# Altium schematic sheet LPCB220 - OVERVIEW.SchDoc
size A3; Address1: Factory 10; Address2: 9-13 Dingley Avenue, Dandeong, VICTORIA 3175, AUSTRALIA; DocumentNumber: 1; Revision: 1; SheetNumber: 1; SheetTotal: 18; Lockie__PCB_SUB_ASSEMBLY: Top Overview; Lockie__PCB_ASSEMBLY: Brake Control; Lockie__LDL: LPCB220; Lockie__PCB_DESCRIPTION: Redundant Stepper Node
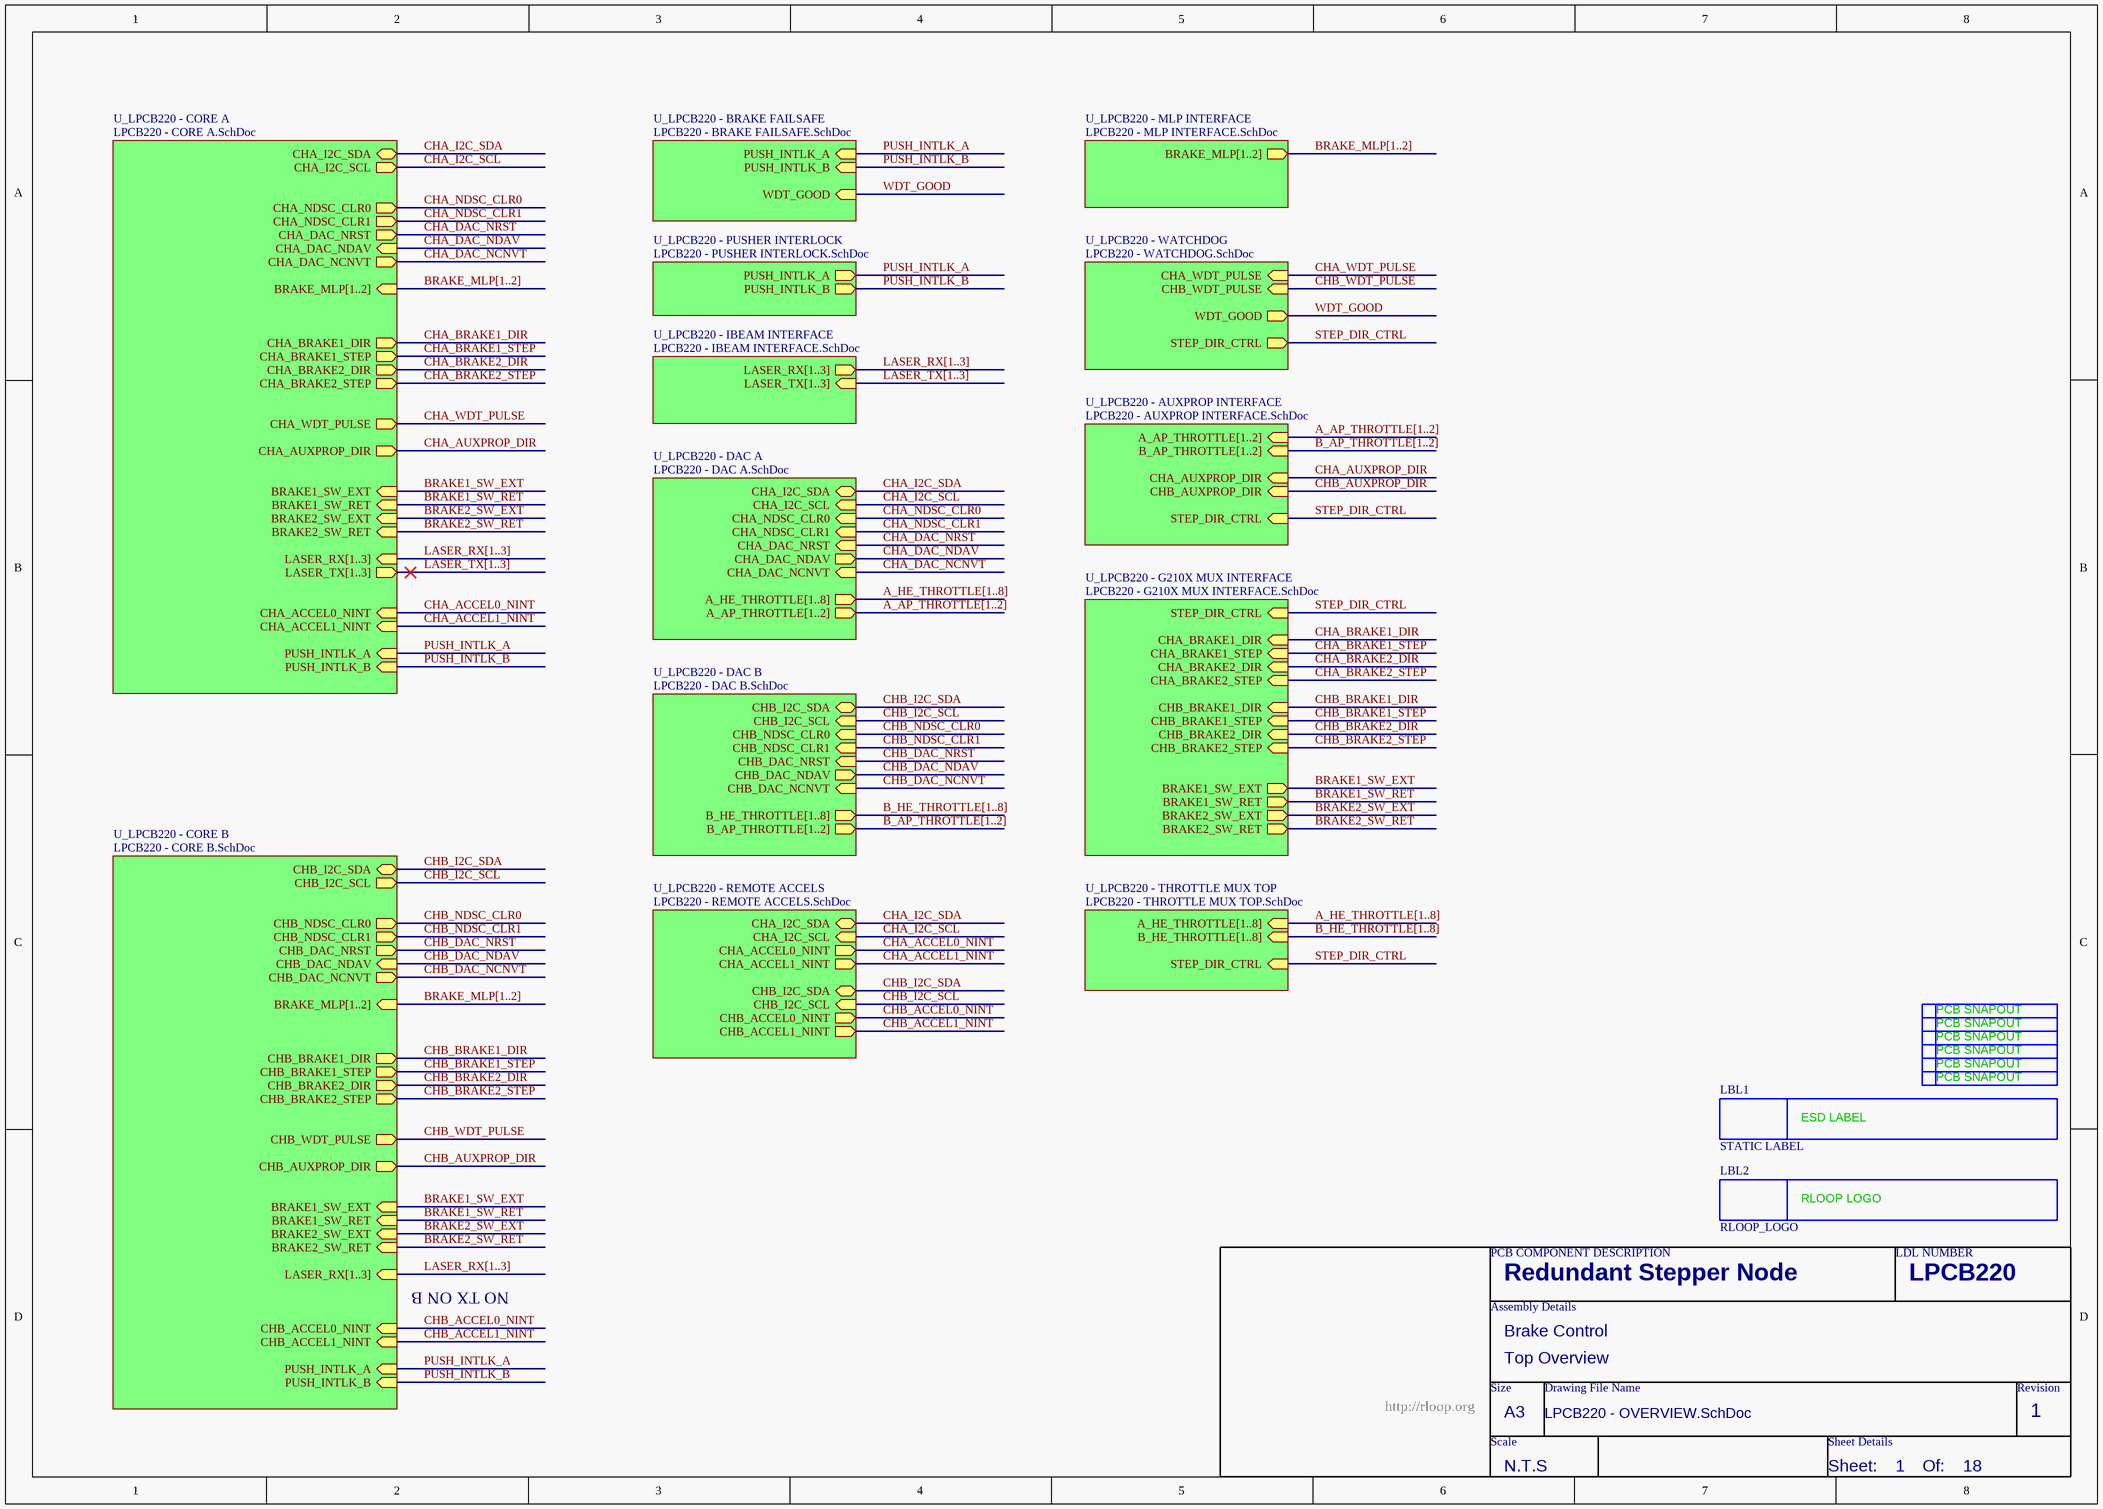
[diagram p0: LPCB220 - OVERVIEW.SchDoc]

## Parts
LBL1  STATIC LABEL  [STATIC_LABEL]  (no BOM)
LBL2  RLOOP_LOGO  [RLOOP_LOGO]  (no BOM)
SN1  PCB_SNAPOUT  [SNAPOUT_NEW]  (value not drawn)  (no BOM)
SN2  PCB_SNAPOUT  [SNAPOUT_NEW]  (value not drawn)  (no BOM)
SN3  PCB_SNAPOUT  [SNAPOUT_NEW]  (value not drawn)  (no BOM)
SN4  PCB_SNAPOUT  [SNAPOUT_NEW]  (value not drawn)  (no BOM)
SN5  PCB_SNAPOUT  [SNAPOUT_NEW]  (value not drawn)  (no BOM)
SN6  PCB_SNAPOUT  [SNAPOUT_NEW]  (value not drawn)  (no BOM)

## Sub-sheets
U_LPCB220 - AUXPROP INTERFACE = LPCB220 - AUXPROP INTERFACE.SchDoc: B_AP_THROTTLE[1..2] (in), A_AP_THROTTLE[1..2] (in), CHB_AUXPROP_DIR (in), CHA_AUXPROP_DIR (in), STEP_DIR_CTRL (in)
U_LPCB220 - BRAKE FAILSAFE = LPCB220 - BRAKE FAILSAFE.SchDoc: PUSH_INTLK_A (in), PUSH_INTLK_B (in), WDT_GOOD (in)
U_LPCB220 - CORE A = LPCB220 - CORE A.SchDoc: CHA_I2C_SDA (bidir), CHA_I2C_SCL (out), LASER_TX[1..3] (out), LASER_RX[1..3] (in), CHA_ACCEL0_NINT (in), CHA_ACCEL1_NINT (in), CHA_AUXPROP_DIR (out), CHA_DAC_NDAV (in), BRAKE1_SW_EXT (in), BRAKE1_SW_RET (in), BRAKE_MLP[1..2] (in), CHA_NDSC_CLR0 (out), CHA_NDSC_CLR1 (out), BRAKE2_SW_EXT (in), BRAKE2_SW_RET (in), PUSH_INTLK_A (in), PUSH_INTLK_B (in), CHA_WDT_PULSE (out), CHA_BRAKE1_DIR (out), CHA_BRAKE1_STEP (out), CHA_BRAKE2_DIR (out), CHA_BRAKE2_STEP (out), CHA_DAC_NRST (out), CHA_DAC_NCNVT (out)
U_LPCB220 - CORE B = LPCB220 - CORE B.SchDoc: CHB_I2C_SDA (bidir), CHB_I2C_SCL (out), LASER_RX[1..3] (in), CHB_ACCEL0_NINT (in), CHB_ACCEL1_NINT (in), CHB_AUXPROP_DIR (out), CHB_DAC_NDAV (in), BRAKE1_SW_EXT (in), BRAKE1_SW_RET (in), BRAKE_MLP[1..2] (in), CHB_NDSC_CLR0 (out), CHB_NDSC_CLR1 (out), BRAKE2_SW_EXT (in), BRAKE2_SW_RET (in), PUSH_INTLK_A (in), PUSH_INTLK_B (in), CHB_WDT_PULSE (out), CHB_BRAKE1_DIR (out), CHB_BRAKE1_STEP (out), CHB_BRAKE2_DIR (out), CHB_BRAKE2_STEP (out), CHB_DAC_NRST (out), CHB_DAC_NCNVT (out)
U_LPCB220 - DAC A = LPCB220 - DAC A.SchDoc: A_HE_THROTTLE[1..8] (out), A_AP_THROTTLE[1..2] (out), CHA_I2C_SDA (bidir), CHA_I2C_SCL (in), CHA_NDSC_CLR0 (in), CHA_NDSC_CLR1 (in), CHA_DAC_NRST (in), CHA_DAC_NDAV (out), CHA_DAC_NCNVT (in)
U_LPCB220 - DAC B = LPCB220 - DAC B.SchDoc: B_HE_THROTTLE[1..8] (out), B_AP_THROTTLE[1..2] (out), CHB_I2C_SDA (bidir), CHB_I2C_SCL (in), CHB_NDSC_CLR0 (in), CHB_NDSC_CLR1 (in), CHB_DAC_NRST (in), CHB_DAC_NDAV (out), CHB_DAC_NCNVT (in)
U_LPCB220 - G210X MUX INTERFACE = LPCB220 - G210X MUX INTERFACE.SchDoc: CHB_BRAKE1_DIR (in), CHA_BRAKE1_DIR (in), CHB_BRAKE2_DIR (in), CHA_BRAKE2_DIR (in), CHB_BRAKE1_STEP (in), CHA_BRAKE1_STEP (in), CHB_BRAKE2_STEP (in), CHA_BRAKE2_STEP (in), STEP_DIR_CTRL (in), BRAKE1_SW_EXT (out), BRAKE1_SW_RET (out), BRAKE2_SW_EXT (out), BRAKE2_SW_RET (out)
U_LPCB220 - IBEAM INTERFACE = LPCB220 - IBEAM INTERFACE.SchDoc: LASER_TX[1..3] (in), LASER_RX[1..3] (out)
U_LPCB220 - MLP INTERFACE = LPCB220 - MLP INTERFACE.SchDoc: BRAKE_MLP[1..2] (out)
U_LPCB220 - PUSHER INTERLOCK = LPCB220 - PUSHER INTERLOCK.SchDoc: PUSH_INTLK_A (out), PUSH_INTLK_B (out)
U_LPCB220 - REMOTE ACCELS = LPCB220 - REMOTE ACCELS.SchDoc: CHA_I2C_SCL (in), CHA_I2C_SDA (bidir), CHB_ACCEL0_NINT (out), CHA_ACCEL1_NINT (out), CHA_ACCEL0_NINT (out), CHB_ACCEL1_NINT (out), CHB_I2C_SCL (in), CHB_I2C_SDA (bidir)
U_LPCB220 - THROTTLE MUX TOP = LPCB220 - THROTTLE MUX TOP.SchDoc: B_HE_THROTTLE[1..8] (in), A_HE_THROTTLE[1..8] (in), STEP_DIR_CTRL (in)
U_LPCB220 - WATCHDOG = LPCB220 - WATCHDOG.SchDoc: CHA_WDT_PULSE (in), CHB_WDT_PULSE (in), STEP_DIR_CTRL (out), WDT_GOOD (out)

## Nets
BRAKE1_SW_EXT: sheet U_LPCB220 - CORE A/BRAKE1_SW_EXT, sheet U_LPCB220 - CORE B/BRAKE1_SW_EXT, sheet U_LPCB220 - G210X MUX INTERFACE/BRAKE1_SW_EXT
BRAKE1_SW_RET: sheet U_LPCB220 - CORE A/BRAKE1_SW_RET, sheet U_LPCB220 - CORE B/BRAKE1_SW_RET, sheet U_LPCB220 - G210X MUX INTERFACE/BRAKE1_SW_RET
BRAKE2_SW_EXT: sheet U_LPCB220 - CORE A/BRAKE2_SW_EXT, sheet U_LPCB220 - CORE B/BRAKE2_SW_EXT, sheet U_LPCB220 - G210X MUX INTERFACE/BRAKE2_SW_EXT
BRAKE2_SW_RET: sheet U_LPCB220 - CORE A/BRAKE2_SW_RET, sheet U_LPCB220 - CORE B/BRAKE2_SW_RET, sheet U_LPCB220 - G210X MUX INTERFACE/BRAKE2_SW_RET
CHA_ACCEL0_NINT: sheet U_LPCB220 - CORE A/CHA_ACCEL0_NINT, sheet U_LPCB220 - REMOTE ACCELS/CHA_ACCEL0_NINT
CHA_ACCEL1_NINT: sheet U_LPCB220 - CORE A/CHA_ACCEL1_NINT, sheet U_LPCB220 - REMOTE ACCELS/CHA_ACCEL1_NINT
CHA_AUXPROP_DIR: sheet U_LPCB220 - AUXPROP INTERFACE/CHA_AUXPROP_DIR, sheet U_LPCB220 - CORE A/CHA_AUXPROP_DIR
CHA_BRAKE1_DIR: sheet U_LPCB220 - CORE A/CHA_BRAKE1_DIR, sheet U_LPCB220 - G210X MUX INTERFACE/CHA_BRAKE1_DIR
CHA_BRAKE1_STEP: sheet U_LPCB220 - CORE A/CHA_BRAKE1_STEP, sheet U_LPCB220 - G210X MUX INTERFACE/CHA_BRAKE1_STEP
CHA_BRAKE2_DIR: sheet U_LPCB220 - CORE A/CHA_BRAKE2_DIR, sheet U_LPCB220 - G210X MUX INTERFACE/CHA_BRAKE2_DIR
CHA_BRAKE2_STEP: sheet U_LPCB220 - CORE A/CHA_BRAKE2_STEP, sheet U_LPCB220 - G210X MUX INTERFACE/CHA_BRAKE2_STEP
CHA_DAC_NCNVT: sheet U_LPCB220 - DAC A/CHA_DAC_NCNVT, sheet U_LPCB220 - CORE A/CHA_DAC_NCNVT
CHA_DAC_NDAV: sheet U_LPCB220 - DAC A/CHA_DAC_NDAV, sheet U_LPCB220 - CORE A/CHA_DAC_NDAV
CHA_DAC_NRST: sheet U_LPCB220 - DAC A/CHA_DAC_NRST, sheet U_LPCB220 - CORE A/CHA_DAC_NRST
CHA_I2C_SCL: sheet U_LPCB220 - DAC A/CHA_I2C_SCL, sheet U_LPCB220 - CORE A/CHA_I2C_SCL, sheet U_LPCB220 - REMOTE ACCELS/CHA_I2C_SCL
CHA_I2C_SDA: sheet U_LPCB220 - DAC A/CHA_I2C_SDA, sheet U_LPCB220 - CORE A/CHA_I2C_SDA, sheet U_LPCB220 - REMOTE ACCELS/CHA_I2C_SDA
CHA_NDSC_CLR0: sheet U_LPCB220 - DAC A/CHA_NDSC_CLR0, sheet U_LPCB220 - CORE A/CHA_NDSC_CLR0
CHA_NDSC_CLR1: sheet U_LPCB220 - DAC A/CHA_NDSC_CLR1, sheet U_LPCB220 - CORE A/CHA_NDSC_CLR1
CHA_WDT_PULSE: sheet U_LPCB220 - WATCHDOG/CHA_WDT_PULSE, sheet U_LPCB220 - CORE A/CHA_WDT_PULSE
CHB_ACCEL0_NINT: sheet U_LPCB220 - REMOTE ACCELS/CHB_ACCEL0_NINT, sheet U_LPCB220 - CORE B/CHB_ACCEL0_NINT
CHB_ACCEL1_NINT: sheet U_LPCB220 - REMOTE ACCELS/CHB_ACCEL1_NINT, sheet U_LPCB220 - CORE B/CHB_ACCEL1_NINT
CHB_AUXPROP_DIR: sheet U_LPCB220 - AUXPROP INTERFACE/CHB_AUXPROP_DIR, sheet U_LPCB220 - CORE B/CHB_AUXPROP_DIR
CHB_BRAKE1_DIR: sheet U_LPCB220 - CORE B/CHB_BRAKE1_DIR, sheet U_LPCB220 - G210X MUX INTERFACE/CHB_BRAKE1_DIR
CHB_BRAKE1_STEP: sheet U_LPCB220 - CORE B/CHB_BRAKE1_STEP, sheet U_LPCB220 - G210X MUX INTERFACE/CHB_BRAKE1_STEP
CHB_BRAKE2_DIR: sheet U_LPCB220 - CORE B/CHB_BRAKE2_DIR, sheet U_LPCB220 - G210X MUX INTERFACE/CHB_BRAKE2_DIR
CHB_BRAKE2_STEP: sheet U_LPCB220 - CORE B/CHB_BRAKE2_STEP, sheet U_LPCB220 - G210X MUX INTERFACE/CHB_BRAKE2_STEP
CHB_DAC_NCNVT: sheet U_LPCB220 - DAC B/CHB_DAC_NCNVT, sheet U_LPCB220 - CORE B/CHB_DAC_NCNVT
CHB_DAC_NDAV: sheet U_LPCB220 - DAC B/CHB_DAC_NDAV, sheet U_LPCB220 - CORE B/CHB_DAC_NDAV
CHB_DAC_NRST: sheet U_LPCB220 - DAC B/CHB_DAC_NRST, sheet U_LPCB220 - CORE B/CHB_DAC_NRST
CHB_I2C_SCL: sheet U_LPCB220 - DAC B/CHB_I2C_SCL, sheet U_LPCB220 - REMOTE ACCELS/CHB_I2C_SCL, sheet U_LPCB220 - CORE B/CHB_I2C_SCL
CHB_I2C_SDA: sheet U_LPCB220 - DAC B/CHB_I2C_SDA, sheet U_LPCB220 - REMOTE ACCELS/CHB_I2C_SDA, sheet U_LPCB220 - CORE B/CHB_I2C_SDA
CHB_NDSC_CLR0: sheet U_LPCB220 - DAC B/CHB_NDSC_CLR0, sheet U_LPCB220 - CORE B/CHB_NDSC_CLR0
CHB_NDSC_CLR1: sheet U_LPCB220 - DAC B/CHB_NDSC_CLR1, sheet U_LPCB220 - CORE B/CHB_NDSC_CLR1
CHB_WDT_PULSE: sheet U_LPCB220 - WATCHDOG/CHB_WDT_PULSE, sheet U_LPCB220 - CORE B/CHB_WDT_PULSE
PUSH_INTLK_A: sheet U_LPCB220 - BRAKE FAILSAFE/PUSH_INTLK_A, sheet U_LPCB220 - PUSHER INTERLOCK/PUSH_INTLK_A, sheet U_LPCB220 - CORE A/PUSH_INTLK_A, sheet U_LPCB220 - CORE B/PUSH_INTLK_A
PUSH_INTLK_B: sheet U_LPCB220 - BRAKE FAILSAFE/PUSH_INTLK_B, sheet U_LPCB220 - PUSHER INTERLOCK/PUSH_INTLK_B, sheet U_LPCB220 - CORE A/PUSH_INTLK_B, sheet U_LPCB220 - CORE B/PUSH_INTLK_B
STEP_DIR_CTRL: sheet U_LPCB220 - WATCHDOG/STEP_DIR_CTRL, sheet U_LPCB220 - AUXPROP INTERFACE/STEP_DIR_CTRL, sheet U_LPCB220 - G210X MUX INTERFACE/STEP_DIR_CTRL, sheet U_LPCB220 - THROTTLE MUX TOP/STEP_DIR_CTRL
WDT_GOOD: sheet U_LPCB220 - BRAKE FAILSAFE/WDT_GOOD, sheet U_LPCB220 - WATCHDOG/WDT_GOOD

## Buses and harness runs
bus A_AP_THROTTLE[1..2] = sheet U_LPCB220 - AUXPROP INTERFACE/A_AP_THROTTLE[1..2]
bus A_AP_THROTTLE[1..2] = sheet U_LPCB220 - DAC A/A_AP_THROTTLE[1..2]
bus A_HE_THROTTLE[1..8] = sheet U_LPCB220 - DAC A/A_HE_THROTTLE[1..8]
bus A_HE_THROTTLE[1..8] = sheet U_LPCB220 - THROTTLE MUX TOP/A_HE_THROTTLE[1..8]
bus B_AP_THROTTLE[1..2] = sheet U_LPCB220 - AUXPROP INTERFACE/B_AP_THROTTLE[1..2]
bus B_AP_THROTTLE[1..2] = sheet U_LPCB220 - DAC B/B_AP_THROTTLE[1..2]
bus B_HE_THROTTLE[1..8] = sheet U_LPCB220 - DAC B/B_HE_THROTTLE[1..8]
bus B_HE_THROTTLE[1..8] = sheet U_LPCB220 - THROTTLE MUX TOP/B_HE_THROTTLE[1..8]
bus BRAKE_MLP[1..2] = sheet U_LPCB220 - CORE A/BRAKE_MLP[1..2]
bus BRAKE_MLP[1..2] = sheet U_LPCB220 - CORE B/BRAKE_MLP[1..2]
bus BRAKE_MLP[1..2] = sheet U_LPCB220 - MLP INTERFACE/BRAKE_MLP[1..2]
bus LASER_RX[1..3] = sheet U_LPCB220 - CORE A/LASER_RX[1..3]
bus LASER_RX[1..3] = sheet U_LPCB220 - CORE B/LASER_RX[1..3]
bus LASER_RX[1..3] = sheet U_LPCB220 - IBEAM INTERFACE/LASER_RX[1..3]
bus LASER_TX[1..3] = sheet U_LPCB220 - CORE A/LASER_TX[1..3]
bus LASER_TX[1..3] = sheet U_LPCB220 - IBEAM INTERFACE/LASER_TX[1..3]

## Notes on the sheet
- NO TX ON B
- PCB COMPONENT DESCRIPTION
- LDL NUMBER
- Assembly Details
- Size
- Drawing File Name
- Revision
- http://rloop.org
- Scale
- A3
- Sheet Details
- N.T.S
- Sheet:
- Of:
- (in symbol PCB_SNAPOUT) PCB SNAPOUT
- (in symbol RLOOP_LOGO) RLOOP LOGO
- (in symbol STATIC LABEL) ESD LABEL

## Library data of the parts
LBL1 = STATIC LABEL: FMEDA__CHANNEL: DIAG; FMEDA__FUNCTION_IN_SYSTEM: *
LBL2 = RLOOP_LOGO: FMEDA__CHANNEL: DIAG; FMEDA__FUNCTION_IN_SYSTEM: *
SN1-SN6 = PCB_SNAPOUT: FMEDA__CHANNEL: DIAG; FMEDA__FUNCTION_IN_SYSTEM: *